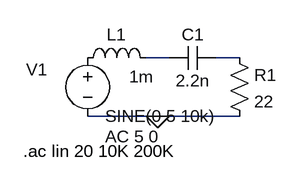
[diagram p0: schematic Πείραμα 8 RLC.asc]
Πείραμα 8 RLC.asc, the LTspice schematic file:
Version 4
SHEET 1 880 680
WIRE 224 80 192 80
WIRE 320 80 288 80
WIRE 208 160 112 160
WIRE 320 160 208 160
FLAG 208 160 0
SYMBOL ind 96 96 R270
WINDOW 0 32 56 VTop 2
WINDOW 3 6 90 VBottom 2
SYMATTR InstName L1
SYMATTR Value 1m
SYMBOL res 304 64 R0
SYMATTR InstName R1
SYMATTR Value 22
SYMBOL cap 288 64 R90
WINDOW 0 0 32 VBottom 2
WINDOW 3 32 32 VTop 2
SYMATTR InstName C1
SYMATTR Value 2.2n
SYMBOL voltage 112 64 R0
WINDOW 0 -84 32 Left 2
WINDOW 123 24 124 Left 2
WINDOW 39 0 0 Left 0
SYMATTR InstName V1
SYMATTR Value SINE(0 5 10k)
SYMATTR Value2 AC 5 0
TEXT 24 208 Left 2 !.ac lin 20 10K 200K

The netlist it stands for:
* Πείραμα 8 RLC.asc
L1 P001 N001 1m
R1 N002 0 22
C1 N002 N001 2.2n
V1 P001 0 SINE(0 5 10k) AC 5 0
.ac lin 20 10K 200K
.backanno
.end